# EAGLE design Pianissimo (EAGLE 9.2.0)
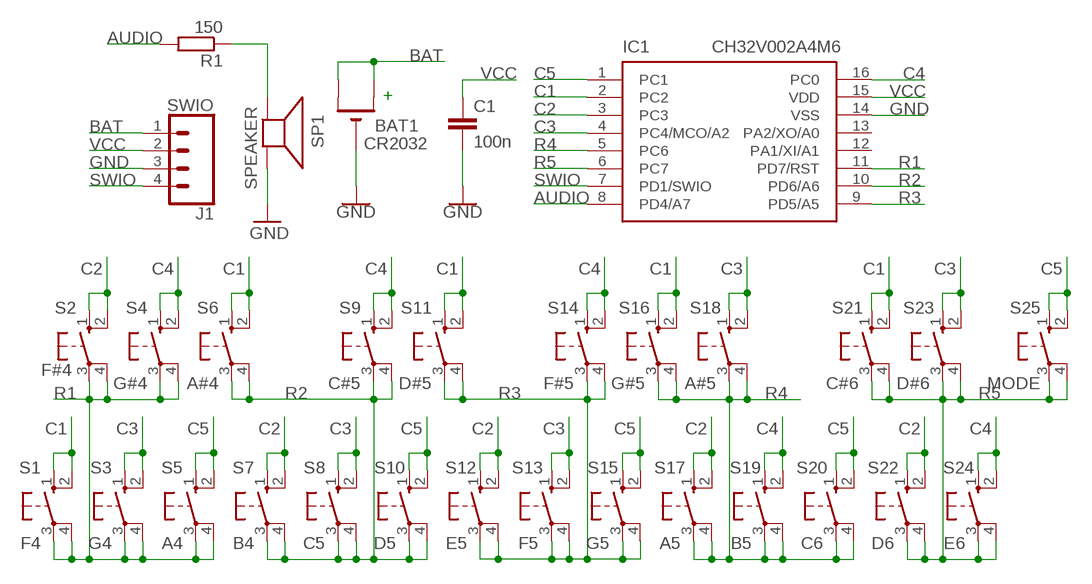
[diagram p0: schematic, sheet 1]

## Parts
BAT1  CR2032  CR2032THM  [CR2032-THRU]
C1  100n  C-EU050-024X044  [C050-024X044]
IC1  CH32V002A4M6  [SOP16]
J1  SWIO  CONN_04LONGPADS  [1X04_LONGPADS]
R1  150  R-EU_0204/7  [0204/7]
S1  F4  10-XX  [B3F-10XX]
S2  F#4  10-XX  [B3F-10XX]
S3  G4  10-XX  [B3F-10XX]
S4  G#4  10-XX  [B3F-10XX]
S5  A4  10-XX  [B3F-10XX]
S6  A#4  10-XX  [B3F-10XX]
S7  B4  10-XX  [B3F-10XX]
S8  C5  10-XX  [B3F-10XX]
S9  C#5  10-XX  [B3F-10XX]
S10  D5  10-XX  [B3F-10XX]
S11  D#5  10-XX  [B3F-10XX]
S12  E5  10-XX  [B3F-10XX]
S13  F5  10-XX  [B3F-10XX]
S14  F#5  10-XX  [B3F-10XX]
S15  G5  10-XX  [B3F-10XX]
S16  G#5  10-XX  [B3F-10XX]
S17  A5  10-XX  [B3F-10XX]
S18  A#5  10-XX  [B3F-10XX]
S19  B5  10-XX  [B3F-10XX]
S20  C6  10-XX  [B3F-10XX]
S21  C#6  10-XX  [B3F-10XX]
S22  D6  10-XX  [B3F-10XX]
S23  D#6  10-XX  [B3F-10XX]
S24  E6  10-XX  [B3F-10XX]
S25  MODE  10-XX  [B3F-10XX]
SP1  SPEAKER  SPEAKER/AL60P  [AL60P]

## Nets
AUDIO: IC1.8(PD4/A7) R1.2
BAT: BAT1.+1(+) BAT1.+2(+1) J1.1
C1: IC1.2(PC2) S1.1(S) S1.2(S1) S6.1(S) S6.2(S1) S11.1(S) S11.2(S1) S16.1(S) S16.2(S1) S21.1(S) S21.2(S1)
C2: IC1.3(PC3) S2.1(S) S2.2(S1) S7.1(S) S7.2(S1) S12.1(S) S12.2(S1) S17.1(S) S17.2(S1) S22.1(S) S22.2(S1)
C3: IC1.4(PC4/MCO/A2) S3.1(S) S3.2(S1) S8.1(S) S8.2(S1) S13.1(S) S13.2(S1) S18.1(S) S18.2(S1) S23.1(S) S23.2(S1)
C4: IC1.16(PC0) S4.1(S) S4.2(S1) S9.1(S) S9.2(S1) S14.1(S) S14.2(S1) S19.1(S) S19.2(S1) S24.1(S) S24.2(S1)
C5: IC1.1(PC1) S5.1(S) S5.2(S1) S10.1(S) S10.2(S1) S15.1(S) S15.2(S1) S20.1(S) S20.2(S1) S25.1(S) S25.2(S1)
GND: BAT1.- C1.2 IC1.14(VSS) J1.3 SP1.2(-)
N$2: R1.1 SP1.1(+)
R1: IC1.11(PD7/RST) S1.3(P) S1.4(P1) S2.3(P) S2.4(P1) S3.3(P) S3.4(P1) S4.3(P) S4.4(P1) S5.3(P) S5.4(P1)
R2: IC1.10(PD6/A6) S6.3(P) S6.4(P1) S7.3(P) S7.4(P1) S8.3(P) S8.4(P1) S9.3(P) S9.4(P1) S10.3(P) S10.4(P1)
R3: IC1.9(PD5/A5) S11.3(P) S11.4(P1) S12.3(P) S12.4(P1) S13.3(P) S13.4(P1) S14.3(P) S14.4(P1) S15.3(P) S15.4(P1)
R4: IC1.5(PC6) S16.3(P) S16.4(P1) S17.3(P) S17.4(P1) S18.3(P) S18.4(P1) S19.3(P) S19.4(P1) S20.3(P) S20.4(P1)
R5: IC1.6(PC7) S21.3(P) S21.4(P1) S22.3(P) S22.4(P1) S23.3(P) S23.4(P1) S24.3(P) S24.4(P1) S25.3(P) S25.4(P1)
SWIO: IC1.7(PD1/SWIO) J1.4
VCC: C1.1 IC1.15(VDD) J1.2
Unconnected: IC1.12(PA1/XI/A1) IC1.13(PA2/XO/A0)

## Notes on the sheet
- +

## Library data of the parts
BAT1 = adafruit_ET58_LCD:CR2032
C1 = rcl:C-EU: CAPACITOR, European symbol; SPICEPREFIX: C
IC1 = CH32V:CH32V002A4M6
J1 = SparkFun-Connectors:CONN_04: Multi connection point. Often used as Generic Header-pin footprint for 0.1 inch spaced/style header connections On any of the 0.1 inch spaced packages, you can populate with these: Break Away Headers - Straight <https://www.sparkfun.com/products/116> (PRT-00116) Break Away Male Headers - Right Angle <https://www.sparkfun.com/products/553> (PRT-00553) Female Headers <https://www.sparkfun.com/products/115> (PRT-00115) Break Away Headers - Machine Pin <https://www.sparkfun.com/products/117> (PRT-00117) Break Away Female Headers - Swiss Machine Pin <https://www.sparkfun.com/products/743> (PRT-00743) For SCREWTERMINALS and SPRING TERMINALS visit here: Screw Terimnals on SparkFun.com <https://www.sparkfun.com/search/results?term=Screw+Terminals> (5mm/3.5mm/2.54mm spacing) This device is also useful as a general connection point to wire up your design to another part of your project. Our various solder wires solder well into these plated through hole pads. Hook-Up Wire - Assortment (Stranded, 22 AWG) <https://www.sparkfun.com/products/11375> (PRT-11375) Hook-Up Wire - Assortment (Solid Core, 22 AWG) <https://www.sparkfun.com/products/11367> (PRT-11367) View the entire wire category on our website here <https://www.sparkfun.com/categories/141> Special notes: Molex polarized connector foot print use with SKU : PRT-08231 with associated crimp pins and housings. 1MM SMD Version SKU: PRT-10208; PROD_ID: CONN-09696
R1 = rcl:R-EU_: RESISTOR, European symbol; SPICEPREFIX: R
S1-S25 = switch-omron:10-XX: OMRON SWITCH; MPN: B3F-1000; OC_FARNELL: 176432; OC_NEWARK: 36M3542
SP1 = adafruit_watch:SPEAKER: SPEAKER Source: Buerklin Added PS12 (for part # PS1240 piezo) http://www.ladyada.net/library/pcb/eaglelibrary.html

## Board
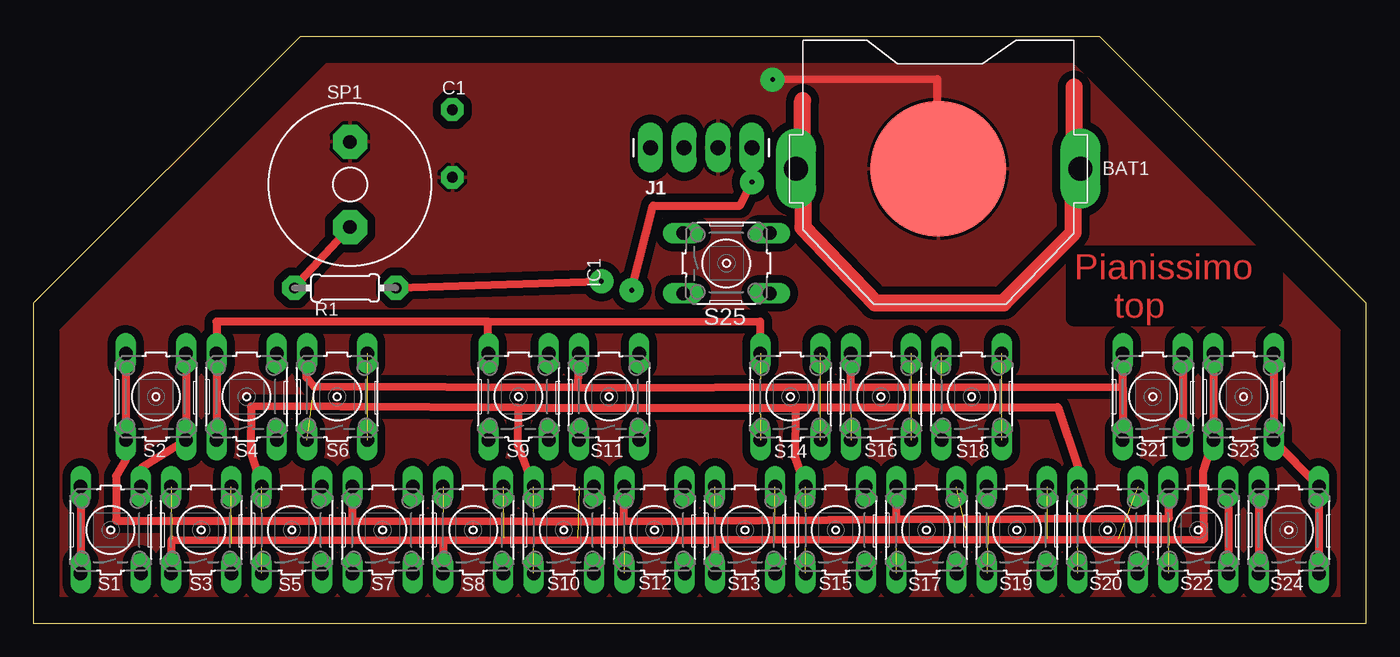
[diagram p1: board, top side]
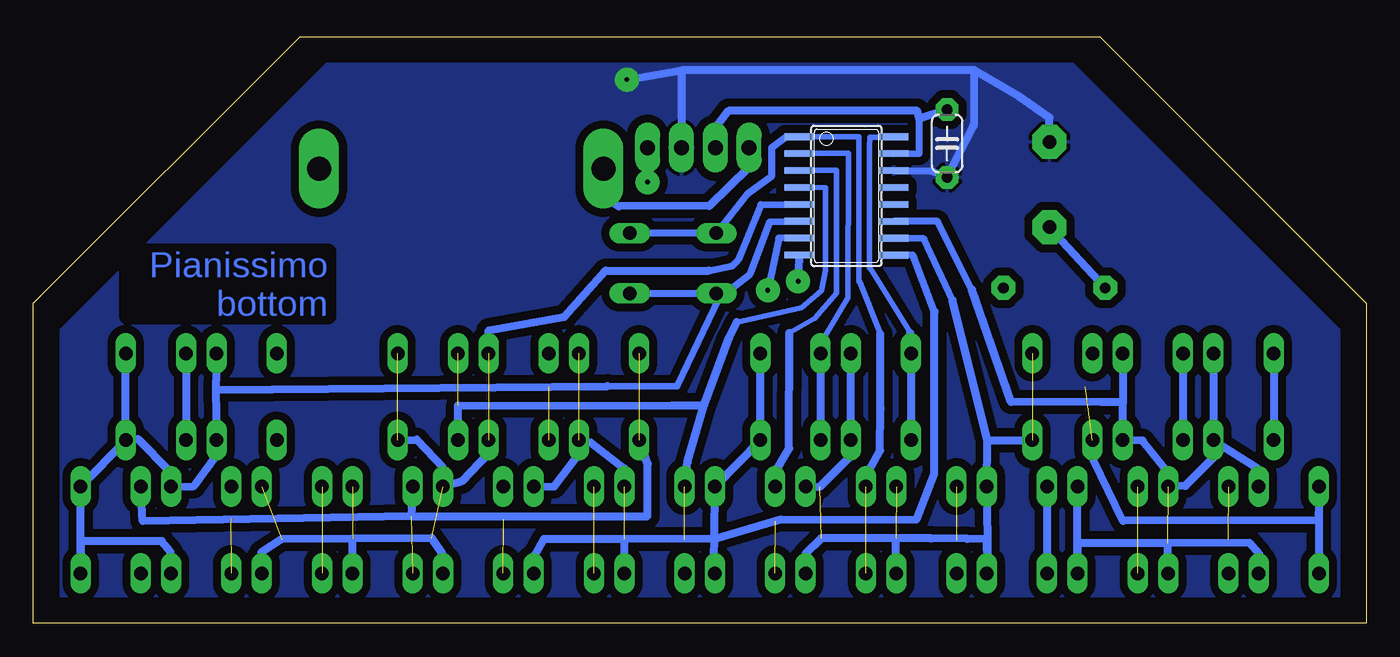
[diagram p2: board, bottom side, seen from below]

Size 100 x 44 mm. Coordinates in mm from the lower left corner, seen from the top.
Outline: 0,0 100,0 100,24 80,44 20,44 0,24 0,0
Copper layers (1*16): Top 0.035mm / dielectric 1.5mm / Bottom 0.035mm
Design rules "default": minimum track width 6mil, minimum drill 0.35mm, track to track 6mil, track to pad 6mil, pad to pad 6mil, via to via 6mil, smd to smd 6mil, copper to edge 40mil, drill to drill 6mil, minimum pad ring 10mil, minimum via ring 8mil, stop-mask expansion 4mil, vias tented up to drill 0mil, thermal gap 10mil

### Footprints (pad centres in the part's own frame; a part is rotated, then mirrored left to right if it is on the bottom)
CR2032-THRU = drill 1.8 pad 3 long: +1 -10.668,0; +2 10.668,0 | smd 10.16 x 10.16: - 0,0
C050-024X044 = drill 0.813 pad 1.7 octagon: 1 -2.54,0; 2 2.54,0
SOP16 = smd 0.5 x 2.2: 1 -4.445,-3.55; 2 -3.185,-3.55; 3 -1.915,-3.55; 4 -0.645,-3.55; 5 0.635,-3.55; 6 1.895,-3.55; 7 3.165,-3.55; 8 4.435,-3.55; 9 4.445,3.55; 10 3.175,3.55; 11 1.905,3.55; 12 0.635,3.55; 13 -0.635,3.55; 14 -1.905,3.55; 15 -3.175,3.55; 16 -4.445,3.55
1X04_LONGPADS = drill 1.118 pad 1.88 long: 1 0,0; 2 2.54,0; 3 5.08,0; 4 7.62,0
0204/7 = drill 0.813 pad 1.8 octagon: 1 -3.81,0; 2 3.81,0
B3F-10XX = drill 1.016 long: 1 -3.251,2.261; 2 3.251,2.261; 3 -3.251,-2.261; 4 3.251,-2.261
AL60P = drill 1.016 pad 2.54 octagon: 1 -3.2,0; 2 3.2,0

### Placement (x,y rotation side)
BAT1  67.89,34.09 0 top
C1  31.44,35.99 270 bottom
IC1  39,32.05 270 bottom
J1  46.29,35.67 0 top
R1  23.4,25.15 0 top
S1  5.8,7 90 top
S2  9.2,17 90 top
S3  12.6,7 90 top
S4  16,17 90 top
S5  19.4,7 90 top
S6  22.8,17 90 top
S7  26.2,7 90 top
S8  33,7 90 top
S9  36.4,17 90 top
S10  39.8,7 90 top
S11  43.2,17 90 top
S12  46.6,7 90 top
S13  53.4,7 90 top
S14  56.8,17 90 top
S15  60.2,7 90 top
S16  63.6,17 90 top
S17  67,7 90 top
S18  70.4,17 90 top
S19  73.8,7 90 top
S20  80.6,7 90 top
S21  84,17 90 top
S22  87.4,7 90 top
S23  90.8,17 90 top
S24  94.2,7 90 top
S25  52,27 0 top
SP1  23.76,32.91 90 top

### Tracks (layer width: path | path; a pad name or v marks a point on that pad's centre or on a via)
AUDIO  (via drill 0.35 pad 1.8)
  Top 0.61: R1.2 v42.61,25.65
  Bottom 0.508: IC1.8 42.56,27.45
  Bottom 0.61: 42.56,27.45 v42.61,25.65
BAT
  Top 1.27: 78.1,40.22 78.1,34.15 BAT1.+2 78,34.1 78.02,29.3 72.79,24.03 63.16,24.03 57.73,29.71 57.78,34.12 BAT1.+1 57.74,34.09 57.71,39.2
  Bottom 0.61: J1.1 46.39,34.14 49.28,31.3 56.08,31.28 57.23,31.93 BAT1.+1
C1  (2 unrouted)
  Top 0.61: 61.36,17.73 81.73,17.7 | S6.2 20.5,18.45 21.07,17.74 40.88,17.67 | 40.88,17.67 S11.2 | 40.88,17.67 61.36,17.73 | 61.36,17.73 S16.2 | 81.73,17.7 S21.2 | S1.2 S1.1 | 81.73,17.7 S21.1
  Bottom 0.406: S11.2 40.59,21.53 38.87,24.42 38.84,35.25 IC1.2
  Bottom 0.61: S6.1 20.62,12.99 20.46,12.29 18.25,7.69 3.59,7.71 3.57,9.06 S1.2 S1.1 | S11.2 S11.1
C2  (3 unrouted)
  Top 0.61: 23.96,7.68 6.21,7.71 6.21,11.06 6.96,12.35 S2.1 S2.2 | 23.96,7.68 S7.2 | 23.96,7.68 36.74,7.65 44.33,7.66 | 44.33,7.66 S12.2 | 44.33,7.66 64.71,7.8 | 64.71,7.8 85.19,7.89 S22.2 | S17.2 64.71,7.8
  Bottom 0.406: 43.27,21.78 41.36,22.88 39.74,24.74 39.75,33.98 IC1.3
  Bottom 0.61: S12.2 44.26,11.46 43.29,13.1 43.27,21.78 | S2.2 S2.1 | S7.2 S7.1
C3  (4 unrouted)
  Top 0.61: S3.1 10.38,6.27 30.75,6.23 | 30.75,6.23 S8.1 | 30.75,6.23 51.16,6.27 | 51.16,6.27 S13.1 | 51.16,6.27 87.84,6.31 87.77,11.35 S23.1 S23.2
  Bottom 0.406: 47.21,22.59 42.39,23.66 40.85,24.94 40.58,26.44 40.56,32.67 IC1.4
  Bottom 0.61: S13.2 50.91,12.11 49.67,16.36 | 49.67,16.36 47.81,21.41 47.21,22.59 | S18.1 68.14,16.33 52.07,16.34 49.67,16.36 | S23.2 S23.1
C4  (2 unrouted)
  Top 0.61: S9.2 34.11,22.62 | 34.11,22.62 13.75,22.62 S4.2 S4.1 | 34.11,22.62 54.53,22.64 S14.2 | S24.2 S24.1
  Bottom 0.406: 34.2,21.79 37.09,26.45 37.25,26.66 37.26,35.73 37.24,36.46 35.98,36.46 IC1.16
  Bottom 0.61: S19.2 71.65,8.03 | 71.65,8.03 91.79,7.67 S24.2 | 34.2,21.79 S9.2 S9.1 | 71.65,8.03 53.94,8.04 53.91,11.97 S14.1 | S4.2 S4.1
C5  (4 unrouted)
  Top 0.61: S10.2 36.35,13.31 36.41,16.17 | 36.41,16.17 16.33,16.27 16.3,12.84 S5.2 | 36.41,16.17 57.15,16.15 57.18,16.2 | 57.18,16.2 57.14,12.44 S15.2 | 57.18,16.2 76.86,16.21 78.37,11.75 S20.2
  Bottom 0.406: 36.45,21.71 37.97,25.56 38.06,25.66 38.07,36.49 40.54,36.48 42.34,36.5 IC1.1
  Bottom 0.508: S25.2 S25.1 46.38,32.25 44.59,33.55 44.59,35.69 43.52,36.49 42.34,36.5
  Bottom 0.61: S10.2 37.49,11.11 36.47,12.95 36.44,16.11 36.45,21.71
GND  (via drill 0.35 pad 1.8)
  Top 0.61: BAT1.- 67.83,40.82 v55.47,40.78
  Bottom 0.508: IC1.14 32.6,33.93
  Bottom 0.61: SP1.2 23.76,37.93 26.02,39.48 29.44,41.49 | 29.44,41.49 29.44,37.41 29.46,37.29 C1.2 32.6,33.93 | 29.44,41.49 51.35,41.48 | 51.35,41.48 J1.3 | v55.47,40.78 51.35,41.48
  pour Bottom (isolate 0.61): 2,2 2,22 22,42 78,42 98,22 98,2
  pour Top (isolate 0.61): 2,2 2,22 22,42 78,42 98,22 98,2
N$2
  Top 0.61: R1.1 SP1.1
  Bottom 0.61: R1.1 SP1.1
R1  (1 unrouted)
  Top 0.61: S2.4 S2.3 8.13,11.68 S1.4
  Bottom 0.508: 29.58,25.03 32.16,30.15 IC1.11
  Bottom 0.61: S1.3 8.04,5.22 8.75,6.03 14.89,6.01 | 14.89,6.01 21.67,6.01 21.66,5.01 S5.3 S5.4 | S3.3 14.89,6.01 | S2.3 11.48,12.43 13.56,10.32 S3.4 14.88,11.31 16.78,13.7 S4.3 18.25,16.57 | 18.25,16.57 19.84,16.59 26.65,16.62 29.58,25.03 | S4.4 18.25,16.57 | S2.4 S2.3 | S2.3 8.13,11.63 S1.4
R2  (3 unrouted)
  Bottom 0.508: 31.03,24.27 33.17,28.84 IC1.10
  Bottom 0.61: S7.3 28.42,4.41 | 28.42,4.41 28.45,6.32 29.93,6.34 32.63,6.37 35.27,6.38 | 35.27,6.38 40.87,6.39 42.05,5.23 S10.3 | S8.3 35.27,6.38 | S10.4 40.98,10.25 38.69,12.52 S9.3 S9.4 | 28.43,13.75 S7.4 28.42,4.41 | 28.43,13.75 S6.3 | 28.43,13.75 31.03,24.27
R3  (2 unrouted)
  Bottom 0.508: 32.39,23.37 34.01,27.63 IC1.9
  Bottom 0.61: S12.3 48.91,5.01 48.89,6.35 | 48.89,6.35 55.66,6.31 | 55.66,6.31 61.72,6.32 62.37,5.15 S15.3 | S13.3 55.66,6.31 | S15.4 60.92,10.27 59.24,12.48 59.09,13.56 | 59.09,13.56 S14.3 | 48.89,6.35 43.94,7.79 33.76,7.78 32.4,11.26 32.39,23.37 | S11.4 S11.3 S12.4 48.89,6.35 | S13.4 55.63,11.61 58.16,13.56 59.09,13.56
R4  (5 unrouted)
  Bottom 0.508: 49.32,26.45 47.55,26.8 47.1,27.27 45.41,31.4 IC1.5
  Bottom 0.61: S16.3 65.84,12.76 67.87,10.62 S17.4 69.27,11.65 71.23,13.78 S18.3 | S17.3 69.3,5.21 70.12,6.38 76.06,6.36 | 76.06,6.36 81.36,6.31 82.88,5.32 S20.3 | S19.3 76.06,6.36 | S16.4 65.83,21.98 60.16,22.98 57.07,26.45 49.32,26.45
R5
  Top 0.61: S21.4 S21.3 | S23.4 S23.3 S24.4 S24.3 | S22.4 S22.3
  Bottom 0.508: IC1.6 44.75,30.11 46.21,26.23 48.51,24.42 | 56.92,17.8 51.68,17.8 48.51,24.42 | 48.51,24.42 S25.3 S25.4
  Bottom 0.61: S22.3 89.71,5.37 90.36,6.16 95.18,6.17 96.44,6.16 S24.3 S24.4 S23.3 | S23.3 92.14,13.81 89.73,11.38 S22.4 87.95,10.3 86.32,12.52 S21.3 86.31,17.53 | S21.4 86.31,17.53 | 86.31,17.53 82.06,17.54 56.92,17.8 | S23.3 S23.4
SWIO  (via drill 0.35 pad 1.8)
  Top 0.61: v44.89,24.99 46.5,31.34 53.01,31.33 v53.91,33.09
  Bottom 0.508: IC1.7 44.07,28.91 v44.89,24.99
  Bottom 0.61: v53.91,33.09 J1.4
VCC
  Bottom 0.508: IC1.15 33.53,35.24 33.53,37.83
  Bottom 0.61: J1.2 48.82,37.17 47.84,38.44 33.68,38.43 33.53,37.83 C1.1

### Text on the board
Top: Pianissimo / top
Bottom: Pianissimo / bottom
Document: BAT | GND | VCC | SWIO